# Altium project MCU.PrjPcb (part 2 of 3)

## Sheet USB.SchDoc
size A; SheetNumber: 3; SheetTotal: 10
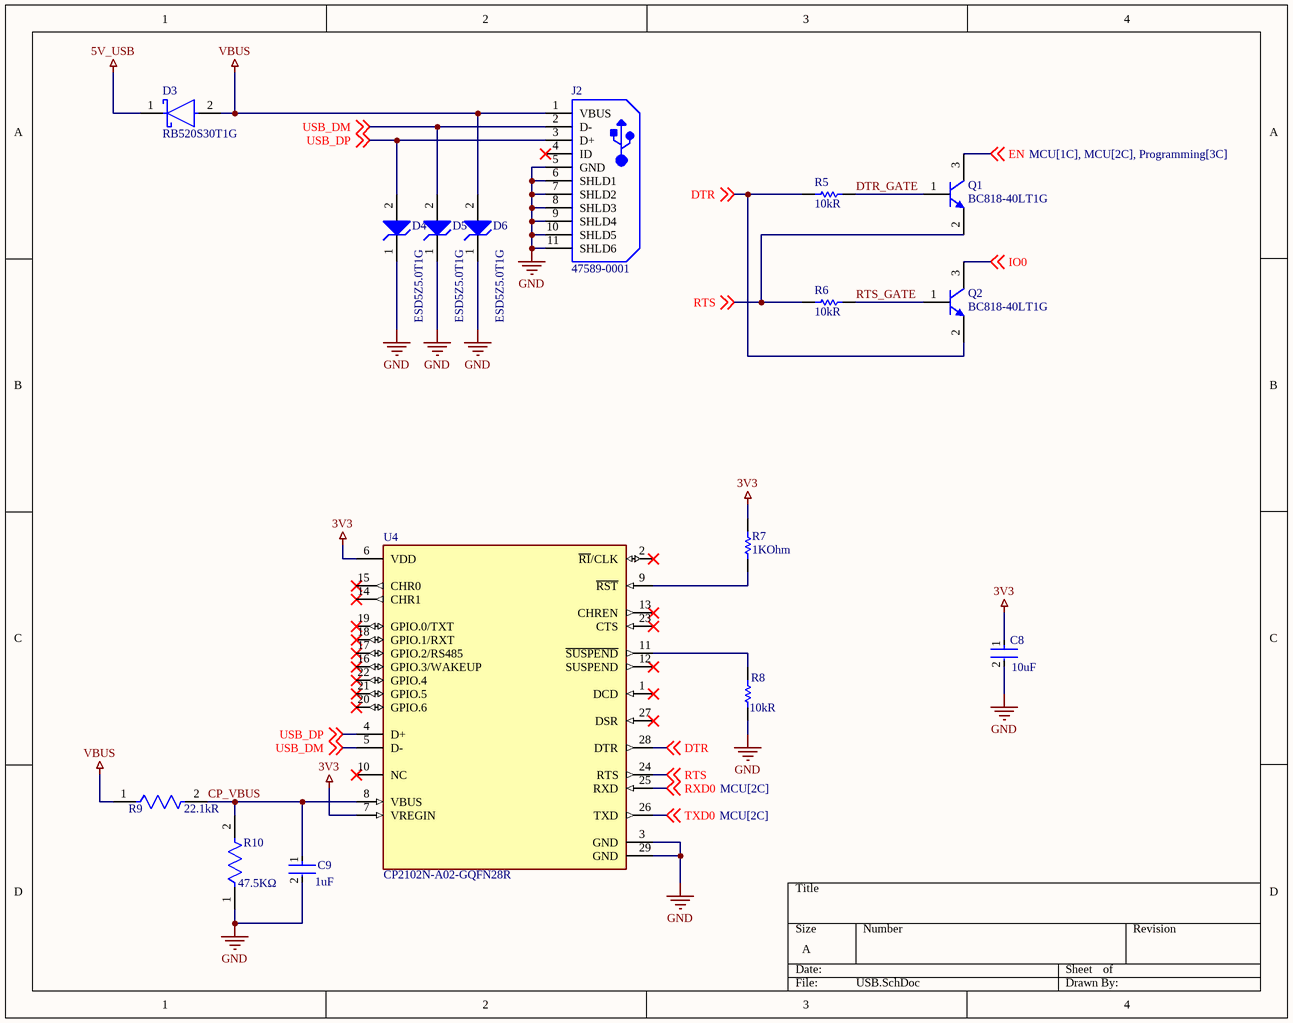
[diagram p2: USB.SchDoc]

### Parts
(Parts that share a designator on the sheet are numbered #1, #2 ... from top to bottom, then left to right.)
C8#2  value 10uF  [FP-C0805C-DG-MFG]  (hidden comment: C0805C106K8PACTU)
C9#2  Capacitance: 1uF  [FP-CL21-IPC_A]  (hidden comment: CL21B105KOFNNNE)
D3#2  RB520S30T1G  [FP-502-01-MFG]
D4#2  ESD5Z5.0T1G  [ONSC-SOD-523-2-502-01_V]
D5#1  ESD5Z5.0T1G  [ONSC-SOD-523-2-502-01_V]
D6  ESD5Z5.0T1G  [ONSC-SOD-523-2-502-01_V]
J2#1  47589-0001  [MOLX-47589-0001_V]
Q1#1  BC818-40LT1G  [ONSC-SOT-23-3-318-08_V]
Q2  BC818-40LT1G  [ONSC-SOT-23-3-318-08_V]
R5#2  value 10kR  [RESC2013X60X35NL10T20]  (hidden comment: RC0805FR-0710KL)
R6#2  value 10kR  [RESC2013X60X35NL10T20]  (hidden comment: RC0805FR-0710KL)
R7#2  Resistance: 1KOhm  [RESC2013X60X35ML10T20]  (hidden comment: RC0805FR-071KL)
R8  value 10kR  [RESC2013X60X35NL10T20]  (hidden comment: RC0805FR-0710KL)
R9#2  Resistance: 22.1kR  [FP-RMCF0805-IPC_B]  (hidden comment: RMCF0805FT22K1)
R10#2  value 47.5KΩ  [FP-RN732A-MFG]  (hidden comment: RN73C2A47K5BTD)
U4#1  CP2102N-A02-GQFN28R  [FP-CP2102N-A02-GQFN28R-MFG]

### Nets
3V3: C8#2.1 R7#2.2 U4#1.6(VDD) U4#1.7(VREGIN)
5V_USB: D3#2.1(C)
GND: C8#2.2 C9#2.2 D4#2.1(K) D5#1.1(K) D6.1(K) J2#1.5(GND) J2#1.6(SHLD1) J2#1.7(SHLD2) J2#1.8(SHLD3) J2#1.9(SHLD4) J2#1.10(SHLD5) J2#1.11(SHLD6) R8.1 R10#2.1 U4#1.3(GND) U4#1.29(GND)
VBUS: D3#2.2(A) D6.2(A) J2#1.1(VBUS) R9#2.1
CP_VBUS: C9#2.1 R9#2.2 R10#2.2 U4#1.8(VBUS)
DTR: Q2.2(E) R5#2.1 U4#1.28(DTR) ; off-sheet DTR
DTR_GATE: Q1#1.1(B) R5#2.2
EN: Q1#1.3(C) ; off-sheet EN
IO0: Q2.3(C) ; off-sheet IO0
RTS: Q1#1.2(E) R6#2.2 U4#1.24(RTS) ; off-sheet RTS
RTS_GATE: Q2.1(B) R6#2.1
RXD0: U4#1.25(RXD) ; off-sheet RXD0
TXD0: U4#1.26(TXD) ; off-sheet TXD0
USB_DM: D5#1.2(A) J2#1.2(D-) U4#1.5(D-) ; off-sheet USB_DM
USB_DP: D4#2.2(A) J2#1.3(D+) U4#1.4(D+) ; off-sheet USB_DP
NetR7#2_1: R7#2.1 U4#1.9(~{RST})
NetR8_2: R8.2 U4#1.11(~{SUSPEND})

Not connected (* = marked no-connect by the designer): J2#1 4(ID)*; U4#1 1(DCD)* 2(~{RI}/CLK)* 10(NC)* 12(SUSPEND)* 13(CHREN)* 14(CHR1)* 15(CHR0)* 16(GPIO.3/WAKEUP)* 17(GPIO.2/RS485)* 18(GPIO.1/RXT)* 19(GPIO.0/TXT)* 20(GPIO.6)* 21(GPIO.5)* 22(GPIO.4)* 23(CTS)* 27(DSR)*

### Library data of the parts
C8#2 = CMP-2007-03243-2: CAP CER 10UF 10V X5R 0805; Manufacturer: Kemet; 3DS Part Number: 220-00001; Tolerance: 10%; Temperature Coefficient: 15%; Material: Ceramic; Multilayer: Yes; Device Class L2: Capacitors; Device Class L1: Passive Components; ComponentLink2URL: https://content.kemet.com/datasheets/KEM_C1006_X5R_SMD.pdf; Height: 1.4mm; Lead Free: Yes; Manufacturer Part Number: C0805C106K8PACTU; Digikey Description: CAP CER 10UF 10V X5R 0805; Octopart: https://octopart.com/c0805c106k8pactu-kemet-98697; Capacitance: 10uF; Temperature Range Low: -55°C; Temperature: -55°C to +85°C; Automotive: No; Mouser Description: CAP CER 10UF 10V X5R 0805; Ipc Land Pattern Name: CAPC200125X125; Temperature Range High: +85°C; Voltage: 10V; RoHS: TRUE; Device Class L3: Ceramic Capacitors; ComponentLink2Description: Datasheet; Voltage Rating: 10V; Package: C0805C-DG; Temperature Characteristic: X5R; Category: Cap; Supplier: Digikey; Supplier Part Number: 399-C0805C106K8PAC7800DKR-ND; Stock: 5628606; Pricing: 1=0.14, 10=0.098, 50=0.0584, 100=0.0459, 500=0.03388, 1000=0.02805 (USD); Mounting Technology: Surface Mount; Pins: 2; Dielectric Material: Ceramic; Package Shape: Rectangular; Case/Package: 0805; Terminal Finish: Nickel; Min Operating Temperature: -55°C; Max Operating Temperature: 85°C; JESD-609 Code: e3; Capacitor Type: Ceramic; Tolerance  (fill in as +-): 10%; Package Style: SMTMeter; Packaging: Tape and Reel; Tolerance (fill in as +-): 10%; Rated DC Voltage (URdc): 10V; Termination: Wraparound; Temperature Characteristics Code: X5R; Length: 2mm; Width: 1.25mm; Reach SVHC Compliant: Yes; RoHS Compliant: Yes; ComponentLink1URL: https://datasheet.ciiva.com:443/pdfs/VipMasterIC/IC/KEME/KEME-S-A0008991665/KEME-S-A0008991665-1.pdf?src-supplier=IHS+Markit; ComponentLink1Description: https://datasheet.ciiva.com:443/pdfs/VipMasterIC/IC/KEME/KEME-S-A0008991665/KEME-S-A0008991665-1.pdf?src-supplier=IHS+Markit
C9#2 = CMP-13271-003098-1: CL21 Series 0805 1uF 16V ±10% Tolerance X7R Multilayer Ceramic Chip Capacitor; Manufacturer: Samsung; Multilayer: Yes; Case Code (Metric): 2012; Width: 0.049inch; Thickness: 0.053inch; Voltage Rating: 16V; Max Operating Temperature: 125°C; Case Code (Imperial): 0805; Height: 1.25mm; Length: 2mm; Case/Package: 0805; Lead Free: Lead Free; Mount: Surface Mount; Tolerance: 10%; Voltage Rating (DC): 16V; Min Operating Temperature: -55°C; Contact Plating: Tin; Depth: 1.25mm; Packaging: Tape and Reel; Package Quantity: 1; Voltage: 16V; Dielectric: X7R; Radiation Hardening: No; Supplier: Digikey; Supplier Part Number: 1276-1026-1-ND; Manufacturer Part Number: CL21B105KOFNNNE; RoHS: Yes; Category: Ceramic Capacitors; Stock: 390405; Pricing: 1=0.1, 10=0.049, 50=0.028, 100=0.0217, 500=0.01636, 1000=0.01286 (USD); Mounting Technology: Surface Mount; Pins: 2; Dielectric Material: Ceramic; Package Shape: Rectangular; Terminal Finish: Nickel; JESD-609 Code: e3; Value: 1uF; Capacitor Type: Ceramic; Tolerance  (fill in as +-): 10%; Package Style: SMTMeter; Tolerance (fill in as +-): 10%; Rated DC Voltage (URdc): 16V; Temperature Characteristics Code: X7R; Termination: Wraparound; Reach SVHC Compliant: Yes; RoHS Compliant: Yes; ComponentLink1URL: https://datasheet.ciiva.com:443/pdfs/VipMasterIC/IC/SEMS/SEMS-S-A0008523115/SEMS-S-A0008523189-1.pdf?src-supplier=IHS+Markit; ComponentLink1Description: https://datasheet.ciiva.com:443/pdfs/VipMasterIC/IC/SEMS/SEMS-S-A0008523115/SEMS-S-A0008523189-1.pdf?src-supplier=IHS+Markit; ComponentLink2URL: https://datasheet.ciiva.com/25800/cl21b105kofnnne-25800257.pdf?src-supplier=Digikey; ComponentLink2Description: https://datasheet.ciiva.com/25800/cl21b105kofnnne-25800257.pdf?src-supplier=Digikey; ComponentLink3URL: https://datasheet.ciiva.com/26838/getdatasheetpartid-358361-26838673.pdf?src-supplier=Verical; ComponentLink3Description: https://datasheet.ciiva.com/26838/getdatasheetpartid-358361-26838673.pdf?src-supplier=Verical; ComponentLink4URL: https://datasheet.ciiva.com/26310/mlcc-catalogdownload2013-eng-26310166.pdf?src-supplier=Distrelec; ComponentLink4Description: https://datasheet.ciiva.com/26310/mlcc-catalogdownload2013-eng-26310166.pdf?src-supplier=Distrelec
D3#2 = CMP-1055-00482-2: DIODE SCHOTTKY 30V 200MA SOD523; Element Configuration: Single; Max Reverse Leakage Current: 1uA; Power Dissipation: 200mW; Forward Voltage: 600mV; Polarity: Standard; Min Operating Temperature: -55°C; Radiation Hardening: No; Average Rectified Current: 200mA; Height: 0.7mm; Package Quantity: 1; Number of Pins: 2; Forward Current: 200mA; Packaging: Tape and Reel; Max Repetitive Reverse Voltage (Vrrm): 30V; Max Forward Surge Current (Ifsm): 200mA; Peak Reverse Current: 1uA; Max Reverse Voltage (DC): 30V; Lead Free: Lead Free; Current Rating: 200mA; Output Current: 200mA; Contact Plating: Tin; Voltage Rating (DC): 30V; Max Operating Temperature: 150°C; Width: 0.9mm; REACH SVHC: No SVHC; Case/Package: SOD-523-2; Length: 1.3mm
D4#2 D5#1 D6 = CMP-1063-00102-1: Transient Voltage Suppressor, Micro-Packaged Diode for ESD Protection, 2-Pin SOD-523, Pb-Free, Tape and Reel; Manufacturer: On Semiconductor; V(BR) Min (V): 6.2; VRWM Max (V): 5; Number of Lines: 1; PPK Max (W): 174; IR Max (uA): 0.05; Direction: Unidirectional; Diode Element Material: SILICON; Package Body Material: Plastic; Min Breakdown Voltage: 6.2V; Diode Type: TRANS VOLTAGE SUPPRESSOR; Clamping Voltage-Max: 11.6V; Rep Pk Reverse Voltage-Max: 5V; Max Power Dissipation: 200mW; Non-rep Peak Rev Power Dis-Max: 174W; Additional Feature: UL RECOGNIZED; Reference Standard: IEC-61000-4-2; Qualification Status: Not Qualified; PackageVersion: Rev. E, 09/2010; Mounting Technology: Surface Mount; Packing: Tape and Reel; ComponentLink2URL: http://www.onsemi.cn/pub_link/Collateral/ESD5Z2.5T1-D.PDF; ComponentLink2Description: Datasheet; PackageReference: SOD-523-2-502-01; ComponentLink1Description: Manufacturer URL; ComponentLink3URL: http://www.onsemi.com/pub_link/Collateral/502-01.PDF; PackageDescription: 2-Pin SOD, Body 1.2 x 0.8 mm; ComponentLink3Description: Package Specification; ComponentLink1URL: http://www.onsemi.com/; RoHS: Pb-Free; PartNumber: ESD5Z5.0T1G; DatasheetVersion: Rev. 10; Supplier: Digikey; Supplier Part Number: ESD5Z5.0T1GOSCT-ND; Manufacturer Part Number: ESD5Z5.0T1G; Category: ESD and Circuit Protection ICs; Stock: 420044; Pricing: 1=0.24, 10=0.162, 100=0.0791, 500=0.06598, 1000=0.04584 (USD); Pins: 2; Package Shape: Rectangular; Terminal Finish: Tin; Min Operating Temperature: -55°C; Max Operating Temperature: 150°C; JESD-609 Code: e3; Polarity: Unidirectional; JESD-30 Code: R-PDSO-F2; Moisture Sensitivity Level: 1; Number of Elements: 1; Package Style: SMALL OUTLINEMeter; Surface Mount: Yes; Technology: AVALANCHE; Terminal Form: Flat; Terminal Position: DUAL; Reach SVHC Compliant: Yes; RoHS Compliant: Yes; ComponentLink4URL: https://datasheet.ciiva.com:443/pdfs/VipMasterIC/IC/ONSM/ONSM-S-A0006325923/ONSM-S-A0006325923-1.pdf?src-supplier=IHS+Markit; ComponentLink4Description: https://datasheet.ciiva.com:443/pdfs/VipMasterIC/IC/ONSM/ONSM-S-A0006325923/ONSM-S-A0006325923-1.pdf?src-supplier=IHS+Markit; ComponentLink5URL: https://datasheet.ciiva.com/27748/1311839-27748800.pdf?src-supplier=Jameco; ComponentLink5Description: https://datasheet.ciiva.com/27748/1311839-27748800.pdf?src-supplier=Jameco; ComponentLink6URL: https://datasheet.ciiva.com/22637/esd5z2-5t1-d-22637184.pdf?src-supplier=Element14; ComponentLink6Description: https://datasheet.ciiva.com/22637/esd5z2-5t1-d-22637184.pdf?src-supplier=Element14; ComponentLink7URL: https://datasheet.ciiva.com/15143/getdatasheetpartid-147990-15143766.pdf?src-supplier=Verical; ComponentLink7Description: https://datasheet.ciiva.com/15143/getdatasheetpartid-147990-15143766.pdf?src-supplier=Verical; ComponentLink8URL: https://datasheet.ciiva.com/30479/0900766b8125092b-30479039.pdf?src-supplier=Rs; ComponentLink8Description: https://datasheet.ciiva.com/30479/0900766b8125092b-30479039.pdf?src-supplier=Rs; ComponentLink9URL: https://datasheet.ciiva.com/22637/1878252-22637182.pdf?src-supplier=Element14; ComponentLink9Description: https://datasheet.ciiva.com/22637/1878252-22637182.pdf?src-supplier=Element14; ComponentLink10URL: https://datasheet.ciiva.com/8084/esd5z2-5t1-d-8084057.pdf?src-supplier=Avnet; ComponentLink10Description: https://datasheet.ciiva.com/8084/esd5z2-5t1-d-8084057.pdf?src-supplier=Avnet; ComponentLink11URL: https://datasheet.ciiva.com/16385/esd5z2-5t1-d-16385093.pdf?src-supplier=Future+Electronics; ComponentLink11Description: https://datasheet.ciiva.com/16385/esd5z2-5t1-d-16385093.pdf?src-supplier=Future+Electronics; ComponentLink12URL: https://datasheet.ciiva.com/339/esd5z2-5t1-d-339749.pdf?src-supplier=Digikey; ComponentLink12Description: https://datasheet.ciiva.com/339/esd5z2-5t1-d-339749.pdf?src-supplier=Digikey; ComponentLink13URL: https://datasheet.ciiva.com/339/esd5z2-5t1-d-339750.pdf?src-supplier=Digikey; ComponentLink13Description: https://datasheet.ciiva.com/339/esd5z2-5t1-d-339750.pdf?src-supplier=Digikey; ComponentLink14URL: https://datasheet.ciiva.com/339/esd5z2-5t1-d-339748.pdf?src-supplier=Digikey; ComponentLink14Description: https://datasheet.ciiva.com/339/esd5z2-5t1-d-339748.pdf?src-supplier=Digikey
J2#1 = CMP-2000-05610-1: Right Angle Female Type AB Micro USB Connector, 30 V, 1.8 A, -30 to 85 degC, RoHS, Tape and Reel; Number of Ports: 1Port; Current Rating: 1.8A; Brand: Molex; Connector Type: MicroUSBTypeABreceptacle; Number of Contacts: 5Contact; Voltage Rating: 30VAC; Color: Black; Product: MicroUSBTypeABConnectors; Package URL: http://www.molex.com/pdm_docs/sd/475890001_sd.pdf; Contact Plating: Gold; Datasheet URL: http://www.molex.com/webdocs/datasheets/pdf/en-us/0475890001_IO_CONNECTORS.pdf; Operating Temperature Range: -20Cto+85C; Termination Style: SMD/SMT; Mounting Angle: Right; Package Reference: 47589-0001; Gender: Female; Package Description: Micro USB Connector, Pitch 0.65 mm, 5 Positions, Body 7.5 x 5.6 mm; Mounting Technology: SurfaceMount; Contact Material: CopperAlloy; Packaging: Reel; RoHS: True; Standard: USB; Manufacturer URL: http://www.molex.com/; Manufacturer: Molex; Datasheet Version: 12/2016; Product Category: USBConnectors; Series: 47589
Q1#1 Q2 = CMP-1048-00772-1: General Purpose Transistor, NPN Silicon, 3-Pin SOT-23, Pb-Free, Tape and Reel; Manufacturer: On Semiconductor; fT Min (MHz): 100; IC Continuous (A): 0.5; Package Body Material: Plastic; Max Collector Current: 500mA; DC Current Gain-Min (hFE): 40; Power Dissipation-Max (Abs): 330mW; Frequency: 100MHz; Collector-emitter Voltage-Max: 25V; Number of Elements: 1; Time @ Peak Reflow Temperature-Max (s): 40s; JEDEC-95 Code: TO-236AB; Qualification Status: Not Qualified; ComponentLink1URL: http://www.onsemi.com/; ComponentLink2URL: http://www.onsemi.com/pub_link/Collateral/BC818-40LT-D.PDF; ComponentLink2Description: Datasheet; ComponentLink1Description: Manufacturer URL; ComponentLink3Description: Package Specification; Mounting Technology: Surface Mount; PackageVersion: Rev. AP, 11/2009; PartNumber: BC818-40LT1G; Packing: Tape and Reel; DatasheetVersion: Rev. 3; RoHS: TRUE; ComponentLink3URL: http://www.onsemi.cn/pub_link/Collateral/318-08.PDF; PackageDescription: 3-Pin Small Outline Transistor, Body 2.92 x 1.3 mm, Pitch 0.95 mm; Polarity: NPN; PackageReference: SOT-23-3-318-08; Supplier: Digikey; Supplier Part Number: BC818-40LT1GOSCT-ND; Manufacturer Part Number: BC818-40LT1G; Category: BJTs; Stock: 14183; Pricing: 1=0.16, 10=0.116, 100=0.0628, 500=0.0493, 1000=0.03424 (USD); Pins: 3; Terminal Finish: Tin; Package Shape: Rectangular; Transistor Element Material: SILICON; Max Operating Temperature: 150°C; JESD-609 Code: e3; Polarity/Channel Type: NPN; Moisture Sensitivity Level: 1; Surface Mount: Yes; JESD-30 Code: R-PDSO-G3; Package Style: SMALL OUTLINEMeter; Peak Reflow Temperature (Cel): 260°C; Terminal Form: Gull Wing; Terminal Position: DUAL; Reach SVHC Compliant: Yes; RoHS Compliant: Yes; ComponentLink4URL: https://datasheet.ciiva.com:443/pdfs/VipMasterIC/IC/ONSM/ONSMS37803/ONSMS37803-1.pdf?src-supplier=IHS+Markit; ComponentLink4Description: https://datasheet.ciiva.com:443/pdfs/VipMasterIC/IC/ONSM/ONSMS37803/ONSMS37803-1.pdf?src-supplier=IHS+Markit; ComponentLink5URL: https://datasheet.ciiva.com/4722/bc818-40lt1-d-4722421.pdf?src-supplier=Mouser; ComponentLink5Description: https://datasheet.ciiva.com/4722/bc818-40lt1-d-4722421.pdf?src-supplier=Mouser; ComponentLink6URL: https://datasheet.ciiva.com/16418/bc818-40lt1-d-16418519.pdf?src-supplier=Future+Electronics; ComponentLink6Description: https://datasheet.ciiva.com/16418/bc818-40lt1-d-16418519.pdf?src-supplier=Future+Electronics; ComponentLink7URL: https://datasheet.ciiva.com/980/bc818-40lt1-d-980725.pdf?src-supplier=Digikey; ComponentLink7Description: https://datasheet.ciiva.com/980/bc818-40lt1-d-980725.pdf?src-supplier=Digikey; ComponentLink8URL: https://datasheet.ciiva.com/980/bc818-40lt1-d-980726.pdf?src-supplier=Digikey; ComponentLink8Description: https://datasheet.ciiva.com/980/bc818-40lt1-d-980726.pdf?src-supplier=Digikey; ComponentLink9URL: https://datasheet.ciiva.com/980/bc818-40lt1-d-980724.pdf?src-supplier=Digikey; ComponentLink9Description: https://datasheet.ciiva.com/980/bc818-40lt1-d-980724.pdf?src-supplier=Digikey
R5#2 R6#2 R8 = CMP-1659-00013-4: Chip Resistor, 10 KOhm, +/- 1%, 0.125 W, -55 to 155 degC, 0805 (2012 Metric), RoHS, Tape and Reel; Manufacturer: Yageo; Voltage Rating: 150 V; Power: 125mW; Rated Temperature: 70°C; Temperature Coefficient: 100ppm/°C; Additional Feature: LASER TRIMMABLE; Working Voltage: 150V; Package Length: 2mm; Package Height: 0.5mm; Package Width: 1.25mm; Mount: Surface Mount; ComponentLink1Description: Manufacturer URL; ComponentLink2URL: http://www.yageo.com/documents/recent/PYu-RC_Group_51_RoHS_L_04.pdf; Pins: 2; Length: 2 mm; Min Operating Temperature: -55 degC; Height: 0.5 mm; Mounting Technology: Surface Mount; RoHSCompliant: true; REACH SVHC: No SVHC; ComponentLink1URL: http://www.yageo.com/; Max Operating Temperature: 155 degC; PackageReference: 0805; DatasheetVersion: Rev. 4, 02/2016; Package Quantity: 5000; Packaging: Tape and Reel; ComponentLink2Description: Datasheet; PackageDescription: 2-Pin Surface Mounted Device, Body 2 x 1.25 mm; Supplier: Digikey; Supplier Part Number: 311-10.0KCRCT-ND; Manufacturer Part Number: RC0805FR-0710KL; RoHS: Yes; Category: Chip SMD Resistors; Stock: 4430741; Pricing: 1=0.1, 10=0.027, 50=0.017, 100=0.0142, 500=0.00976, 1000=0.00844 (USD); Package Shape: Rectangular; Terminal Finish: Nickel; Case/Package: 0805; Tolerance: 1%; JESD-609 Code: e3; Resistor Type: FIXED RESISTOR; Construction: Chip; Package Style: SMTMeter; Technology: METAL GLAZE/THICK FILM; Termination: Wraparound; Reach SVHC Compliant: Yes; RoHS Compliant: Yes; ComponentLink3URL: https://datasheet.ciiva.com:443/pdfs/VipMasterIC/IC/YAGO/YAGO-S-A0008145938/YAGO-S-A0008145938-1.pdf?src-supplier=IHS+Markit; ComponentLink3Description: https://datasheet.ciiva.com:443/pdfs/VipMasterIC/IC/YAGO/YAGO-S-A0008145938/YAGO-S-A0008145938-1.pdf?src-supplier=IHS+Markit; ComponentLink4URL: https://datasheet.ciiva.com/11808/0900766b8106beab-11808151.pdf?src-supplier=Rs; ComponentLink4Description: https://datasheet.ciiva.com/11808/0900766b8106beab-11808151.pdf?src-supplier=Rs; ComponentLink5URL: https://datasheet.ciiva.com/46447/444164-46447563.pdf?src-supplier=Element14; ComponentLink5Description: https://datasheet.ciiva.com/46447/444164-46447563.pdf?src-supplier=Element14; ComponentLink6URL: https://datasheet.ciiva.com/2456/pyu-r-int-thick-7-2456973.pdf?src-supplier=Digikey; ComponentLink6Description: https://datasheet.ciiva.com/2456/pyu-r-int-thick-7-2456973.pdf?src-supplier=Digikey; ComponentLink7URL: https://datasheet.ciiva.com/2456/pyu-r-int-thick-7-2456974.pdf?src-supplier=Digikey; ComponentLink7Description: https://datasheet.ciiva.com/2456/pyu-r-int-thick-7-2456974.pdf?src-supplier=Digikey; ComponentLink8URL: https://datasheet.ciiva.com/2456/pyu-r-int-thick-7-2456972.pdf?src-supplier=Digikey; ComponentLink8Description: https://datasheet.ciiva.com/2456/pyu-r-int-thick-7-2456972.pdf?src-supplier=Digikey; ComponentLink9URL: https://datasheet.ciiva.com/12669/rc0805-12669688.pdf?src-supplier=Mouser; ComponentLink9Description: https://datasheet.ciiva.com/12669/rc0805-12669688.pdf?src-supplier=Mouser; ComponentLink10URL: https://datasheet.ciiva.com/16747/rc0805-16747087.pdf?src-supplier=Future+Electronics; ComponentLink10Description: https://datasheet.ciiva.com/16747/rc0805-16747087.pdf?src-supplier=Future+Electronics
R7#2 = CMP-2100-03671-1: Chip Resistor, 1 KOhm, +/- 1%, 125 mW, -55 to 155 degC, 0805 (2012 Metric), RoHS, Tape and Reel; Manufacturer: Yageo; Temperature Coefficient: 100ppm/degreesC; Voltage Rating (DC): 150V; Max Power Dissipation: 125mW; Additional Feature: LASER TRIMMABLE; Rated Temperature: 70°C; Value: 1kR; Package Height: 0.5mm; Package Length: 2mm; Package Width: 1.25mm; Number of Pins: 2; Number of Terminations: 2; Datasheet URL: http://www.yageo.com/NewPortal/yageodocoutput?fileName=/pdf/R-Chip/PYu-RC_Group_51_RoHS_L_5.pdf; Length: 0.079inch; Package Description: 2-Pin Surface Mounted Device, Body 2 x 1.25 mm; Depth: 1.25mm; Height: 0.024inch; Military Standard: Not; Case/Package: 0805; Package Reference: 0805; RoHSCompliant: true; Lead Free: LeadFree; Packaging: TapeandReel; Package Quantity: 1; Datasheet Version: Rev. 5, 10/2016; Tolerance: 1%; Min Operating Temperature: -55degC; Voltage Rating: 150V; Composition: ThickFilm; Case Code (Imperial): 0805; Power Rating: 125mW; Width: 0.049inch; Case Code (Metric): 2012; Manufacturer URL: http://www.yageo.com/; Max Operating Temperature: 155degC; REACH SVHC: Unknown; Termination: SMD/SMT; Supplier: Digikey; Supplier Part Number: 311-1.00KCRCT-ND; Manufacturer Part Number: RC0805FR-071KL; RoHS: Yes; Category: Chip SMD Resistors; Stock: 3362703; Pricing: 1=0.1, 10=0.025, 50=0.016, 100=0.0133, 500=0.00912, 1000=0.00787 (USD); Mounting Technology: Surface Mount; Pins: 2; Package Shape: Rectangular; Terminal Finish: Nickel; JESD-609 Code: e3; Resistor Type: FIXED RESISTOR; Construction: Chip; Package Style: SMTMeter; Power: 125mW; Technology: METAL GLAZE/THICK FILM; Working Voltage: 150V; Reach SVHC Compliant: Yes; RoHS Compliant: Yes; ComponentLink1URL: https://datasheet.ciiva.com:443/pdfs/VipMasterIC/IC/YAGO/YAGO-S-A0008145938/YAGO-S-A0008145938-1.pdf?src-supplier=IHS+Markit; ComponentLink1Description: https://datasheet.ciiva.com:443/pdfs/VipMasterIC/IC/YAGO/YAGO-S-A0008145938/YAGO-S-A0008145938-1.pdf?src-supplier=IHS+Markit; ComponentLink2URL: https://datasheet.ciiva.com/7941/1686128-7941719.pdf?src-supplier=Element14; ComponentLink2Description: https://datasheet.ciiva.com/7941/1686128-7941719.pdf?src-supplier=Element14; ComponentLink3URL: https://datasheet.ciiva.com/46385/444164-46385020.pdf?src-supplier=Element14; ComponentLink3Description: https://datasheet.ciiva.com/46385/444164-46385020.pdf?src-supplier=Element14; ComponentLink4URL: https://datasheet.ciiva.com/2456/pyu-r-int-thick-7-2456976.pdf?src-supplier=Digikey; ComponentLink4Description: https://datasheet.ciiva.com/2456/pyu-r-int-thick-7-2456976.pdf?src-supplier=Digikey; ComponentLink5URL: https://datasheet.ciiva.com/2456/pyu-r-int-thick-7-2456977.pdf?src-supplier=Digikey; ComponentLink5Description: https://datasheet.ciiva.com/2456/pyu-r-int-thick-7-2456977.pdf?src-supplier=Digikey; ComponentLink6URL: https://datasheet.ciiva.com/2456/pyu-r-int-thick-7-2456975.pdf?src-supplier=Digikey; ComponentLink6Description: https://datasheet.ciiva.com/2456/pyu-r-int-thick-7-2456975.pdf?src-supplier=Digikey; ComponentLink7URL: https://datasheet.ciiva.com/16850/rc0805-16850409.pdf?src-supplier=Future+Electronics; ComponentLink7Description: https://datasheet.ciiva.com/16850/rc0805-16850409.pdf?src-supplier=Future+Electronics
R9#2 = CMP-26527-001411-1: 22.1kΩ ±1% 0.125W 0805 Thick Film Chip Resistor AEC-Q200 compliant; Manufacturer: Stackpole Electronics; Temperature Coefficient: 100ppm/°C; Power Rating: 125mW; Rated Temperature: 70°C; Value: 22.1kR; Working Voltage: 150V; Package Height: 0.5mm; Package Length: 2mm; Package Width: 1.25mm; Min Operating Temperature: -55°C; Size Code: 0805; Max Operating Temperature: 155°C; Military Standard: Not; Features: Automotive AEC-Q200; Lead Free: Lead Free; Contact Plating: Tin; Tolerance: 1%; Series: RMCF; Resistor Type: Thick Film; Width: 0.049inch; Case Code (Imperial): 0805; Case/Package: 0805; Depth: 1.25mm; Mount: Surface Mount; RoHS Compliant: Yes; Max Power Dissipation: 125mW; Case Code (Metric): 2012; Height: 0.026inch; Construction: Rectangular; Number of Terminations: 2; Packaging: Tape and Reel; Radiation Hardening: No; Length: 0.079inch; Supplier: Digikey; Supplier Part Number: RMCF0805FT22K1CT-ND; Manufacturer Part Number: RMCF0805FT22K1; RoHS: Yes; Category: Chip SMD Resistors; Stock: 745768; Pricing: 1=0.1, 10=0.02, 50=0.0124, 100=0.0103, 500=0.007, 1000=0.00601 (USD); Mounting Technology: Surface Mount; Pins: 2; Package Shape: Rectangular; Terminal Finish: Nickel; JESD-609 Code: e3; Package Style: SMTMeter; Power: 125mW; Technology: METAL GLAZE/THICK FILM; Termination: Wraparound; Reference Standard: AEC-Q200; Reach SVHC Compliant: Yes; ComponentLink1URL: https://datasheet.ciiva.com:443/pdfs/VipMasterIC/IC/SEIE/SEIE-S-A0009541969/SEIE-S-A0009541969-1.pdf?src-supplier=IHS+Markit; ComponentLink1Description: https://datasheet.ciiva.com:443/pdfs/VipMasterIC/IC/SEIE/SEIE-S-A0009541969/SEIE-S-A0009541969-1.pdf?src-supplier=IHS+Markit; ComponentLink2URL: https://datasheet.ciiva.com/15193/getdatasheetpartid-409700-15193558.pdf?src-supplier=Verical; ComponentLink2Description: https://datasheet.ciiva.com/15193/getdatasheetpartid-409700-15193558.pdf?src-supplier=Verical
R10#2 = CMP-03211-007667-1: SMD Chip Resistor, Thin Film, 47.5KΩ, 100 V, 0805 [2012 Metric], 100 mW, 0.1%, RN73 Series; Manufacturer: TE Connectivity; Voltage Rating: 100V; Temperature Coefficient: 10ppm/°C; Power Rating: 0.1W; Additional Feature: PRECISION; Power: 100mW; Rated Temperature: 70°C; Category: Res; Manufacturer Part Number: RN73C2A47K5BTD; packaging: 5000 Reel; Temperature Range Low: -55°C; Device Class L3: Chip SMD Resistors; Height: 0.65mm; Automotive: No; ComponentLink2Description: Datasheet; Tolerance: 0.1%; ComponentLink2URL: https://www.te.com/commerce/DocumentDelivery/DDEController?Action=showdoc&DocId=Data+Sheet%7F1773270%7FP%7Fpdf%7FEnglish%7FENG_DS_1773270_P.pdf%7F1676162-2; RoHS: TRUE; Temperature Range High: 155°C; Lead Free: Yes; Octopart: https://octopart.com/rn73c2a47k5btd-te+connectivity-22736876; Package: RN732A; Device Class L1: Passive Components; Temperature: -55°C to 155°C; Device Class L2: Resistors; octopart_url: https://octopart.com/rn73c2a47k5btd-te+connectivity-22736876; Ipc Land Pattern Name: RESC200125X55; Resistance: 47.5KΩ; Series: RN73; Composition: Thin Film; Supplier: Digikey; Supplier Part Number: A119902CT-ND; Stock: 2760; Pricing: 1=0.73, 10=0.521, 50=0.3986, 100=0.3526, 500=0.26204, 1000=0.22944 (USD); Mounting Technology: Surface Mount; Pins: 2; Package Shape: Rectangular; Case/Package: 0805; Min Operating Temperature: -55°C; Max Operating Temperature: 125°C; Resistor Type: FIXED RESISTOR; Manufacturer Series: RN73; Technology: THIN FILM; Termination: Wraparound; Working Voltage: 100V; RoHS Compliant: Yes; ComponentLink1URL: https://datasheet.ciiva.com:443/pdfs/VipMasterIC/IC/TYEC/TYECS00448/TYECS00448-1.pdf?src-supplier=IHS+Markit; ComponentLink1Description: https://datasheet.ciiva.com:443/pdfs/VipMasterIC/IC/TYEC/TYECS00448/TYECS00448-1.pdf?src-supplier=IHS+Markit; ComponentLink3URL: https://datasheet.ciiva.com/2547/eng-ds-1773270-m-2547934.pdf?src-supplier=Digikey; ComponentLink3Description: https://datasheet.ciiva.com/2547/eng-ds-1773270-m-2547934.pdf?src-supplier=Digikey
U4#1 = CMP-08093-000007-1: IC USB TO UART BRIDGE QFN28

## Sheet Motor.SchDoc
size A; SheetNumber: 3; SheetTotal: 4
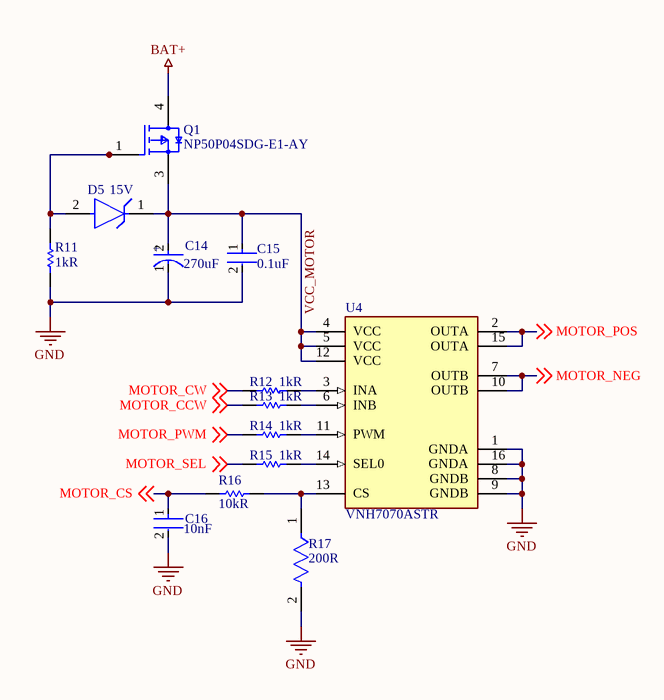
[diagram p3: Motor.SchDoc]

### Parts
(Parts that share a designator on the sheet are numbered #1, #2 ... from top to bottom, then left to right.)
C14#1  Capacitance: 270uF  [FP-EEH-G-MFG]  (hidden comment: EEHZT1V271P)
C15#1  Capacitance: 0.1uF  [FP-GCD21B-0_15-IPC_B]  (hidden comment: GCD21BR71H104MA01L)
C16#1  Capacitance: 10nF  [FP-C0805C103K8RACAUTO-MFG]  (hidden comment: C0805C103K8RACAUTO)
D5#2  Nom Zener Voltage: 15V  [FP-SOD123-MFG]  (hidden comment: MMSZ5245B-7-F)
Q1#2  NP50P04SDG-E1-AY  [DPAK230P1010X240-3_PRSS0004ZV-A_N]
R11  Resistance: 1kR  [RESC2013X60X35LL10T20]  (hidden comment: AC0805JR-071KL)
R12  Resistance: 1kR  [RESC2013X60X35LL10T20]  (hidden comment: AC0805JR-071KL)
R13#1  Resistance: 1kR  [RESC2013X60X35LL10T20]  (hidden comment: AC0805JR-071KL)
R14#1  Resistance: 1kR  [RESC2013X60X35LL10T20]  (hidden comment: AC0805JR-071KL)
R15#1  Resistance: 1kR  [RESC2013X60X35LL10T20]  (hidden comment: AC0805JR-071KL)
R16#1  value 10kR  [RESC2013X60X35NL10T20]  (hidden comment: RC0805FR-0710KL)
R17#1  Resistance: 200R  [FP-CRCW0805-HPe3-IPC_B]  (hidden comment: CRCW0805200RFKEAHP)
U4#2  VNH7070ASTR  [FP-SO-16N-GAPGCFT00818-MFG]

### Nets
BAT+: Q1#2.4(DRAIN)
GND: C14#1.1(C) C15#1.2 C16#1.2 R11.1 R17#1.2 U4#2.1(GNDA) U4#2.8(GNDB) U4#2.9(GNDB) U4#2.16(GNDA)
MOTOR_CCW: R13#1.1 ; off-sheet MOTOR_CCW
MOTOR_CS: C16#1.1 R16#1.1 ; off-sheet MOTOR_CS
MOTOR_CW: R12.1 ; off-sheet MOTOR_CW
MOTOR_NEG: U4#2.7(OUTB) U4#2.10(OUTB) ; off-sheet MOTOR_NEG
MOTOR_POS: U4#2.2(OUTA) U4#2.15(OUTA) ; off-sheet MOTOR_POS
MOTOR_PWM: R14#1.1 ; off-sheet MOTOR_PWM
MOTOR_SEL: R15#1.1 ; off-sheet MOTOR_SEL
VCC_MOTOR: C14#1.2(A) C15#1.1 D5#2.1(C) Q1#2.3(SOURCE) U4#2.4(VCC) U4#2.5(VCC) U4#2.12(VCC)
NetD5#2_2: D5#2.2(A) Q1#2.1(GATE) R11.2
NetR12_2: R12.2 U4#2.3(INA)
NetR13#1_2: R13#1.2 U4#2.6(INB)
NetR14#1_2: R14#1.2 U4#2.11(PWM)
NetR15#1_2: R15#1.2 U4#2.14(SEL0)
NetR16#1_2: R16#1.2 R17#1.1 U4#2.13(CS)

### Notes on the sheet
- (in symbol CMP-05428-001040-1) +

### Library data of the parts
C14#1 = CMP-05428-001040-1: Conductive Polymer Hybrid Aluminum Electrolytic Capacitors 270uF ±20% 35V RADIAL SMT 10x10.2mm; RoHS Compliant: Yes
C15#1 = CMP-06035-004518-1: Chip Multilayer Ceramic Capacitors for Automotive, 0805, 0.10uF, X7R, 15%, 20%, 50V, Grade 1
C16#1 = CMP-00212-126448506-1: C0805C103K8RACAUTO Cap, 0.01UF, 10V, Mlcc, 0805 Rohs Compliant: Yes; Material: Ceramic; Dielectric: X7R; Tolerance: 10%; Height: 880µm; NexarPartId: 126448506; Voltage Rating: 10V; Voltage Rating (DC): 10V; Min Operating Temperature: -55°C; Max Operating Temperature: 125°C; Case/Package: 0805; RoHS: Compliant
D5#2 = CMP-12792-000001-1: DIODE ZENER 15V 500MW SOD123; Manufacturer: Diodes Inc.; Power Dissipation: 370mW; Max Zener Voltage: 15.75V; Max Junction Temp: +150°C; Zener Impedance: 16Ω; Standoff Height: 0mm; Reverse Voltage: 11V; Max Reverse Leakage Current: 0.1uA; Device Class L3: Zener Diodes; Device Class L2: Diodes; Automotive: No; Device Class L1: Discrete Semiconductors; ComponentLink2URL: https://www.diodes.com/assets/Datasheets/ds18010.pdf; Package: SOD123; ComponentLink2Description: Datasheet; Digikey Description: DIODE ZENER 15V 500MW SOD123; RoHS: TRUE; Temperature: -65°C to +150°C; Octopart: https://octopart.com/mmsz5245b-7-f-diodes+inc.-332054; Mouser Description: Zener Diodes 15V 500mW; Height: 1.45mm; Temperature Range Low: -65°C; Lead Free: Yes; Manufacturer Part Number: MMSZ5245B-7-F; Footprint Url: https://www.diodes.com/assets/Package-Files/SOD123.pdf; Category: Diode; Temperature Range High: +150°C
Q1#2 = CMP-00572-18642745-1: Mosfet, P -Ch, 40V, 50A, To-252 Rohs Compliant: Yes; Manufacturer Lifecycle Status: ACTIVE; Drain to Source Voltage (Vdss): -40V; Rds On Max: 9.6mΩ; Fall Time: 180ns; Continuous Drain Current (ID): -50A; Turn-On Delay Time: 13ns; Gate to Source Voltage (Vgs): -20V; Max Power Dissipation: 1.2W; Max Junction Temperature (Tj): 175°C; Turn-Off Delay Time: 405ns; Input Capacitance: 5nF; Number of Elements: 1; Number of Pins: 3; Part Family: NP50P04SDG; Harmonized Tariff Schedule (HTS) Code: 8541.21.0095; HelpURL: https://octopart.com/cad-content/api/get-model-datasheet/15189/18642745; ComponentLink2URL: https://octopart.com/cad-content/api/get-model-datasheet/15189/18642745; Max Operating Temperature: 175°C; Length: 6mm; Height: 2.4mm; Radiation Hardening: No; Lifecycle Status: Production; Mount: Surface Mount; ComponentLink2Description: Datasheet URL; ComponentLink1Description: Manufacturer's Website; ComponentLink3Description: Manufacturer's Package Drawing; Lead Free: Lead Free; RoHS: Compliant; Case/Package: TO-252; ComponentLink3URL: https://www.renesas.com/en/document/psc/package-drawing-mp-3zk-3pin-prss0004zv; Drain to Source Resistance: 9.6MΩ; ComponentLink1URL: http://www.renesas.com; China RoHS: Compliant; MSL: 1; Export Control Classification Number (ECCN) Code: EAR99; Power Dissipation: 1.2W; Min Operating Temperature: -55°C; Rise Time: 13ns; Width: 6mm
R11 R12 R13#1 R14#1 R15#1 = CMP-2001-04511-1: Manufacturer: Yageo; Part Number: AC0805JR-071KL
R16#1 = CMP-1659-00013-4: as R5#2 on sheet USB; Mount: Surface Mount; ComponentLink1Description: Manufacturer URL; ComponentLink2URL: http://www.yageo.com/documents/recent/PYu-RC_Group_51_RoHS_L_04.pdf; Pins: 2; Length: 2 mm; Min Operating Temperature: -55 degC; Height: 0.5 mm; Mounting Technology: Surface Mount; RoHSCompliant: true; REACH SVHC: No SVHC; ComponentLink1URL: http://www.yageo.com/; Max Operating Temperature: 155 degC; PackageReference: 0805; DatasheetVersion: Rev. 4, 02/2016; Package Quantity: 5000; Packaging: Tape and Reel; ComponentLink2Description: Datasheet; PackageDescription: 2-Pin Surface Mounted Device, Body 2 x 1.25 mm; Supplier: Digikey; Supplier Part Number: 311-10.0KCRCT-ND; Manufacturer Part Number: RC0805FR-0710KL; RoHS: Yes; Category: Chip SMD Resistors; Stock: 4430741; Pricing: 1=0.1, 10=0.027, 50=0.017, 100=0.0142, 500=0.00976, 1000=0.00844 (USD); Package Shape: Rectangular; Terminal Finish: Nickel; Case/Package: 0805; Tolerance: 1%; JESD-609 Code: e3; Resistor Type: FIXED RESISTOR; Construction: Chip; Package Style: SMTMeter; Technology: METAL GLAZE/THICK FILM; Termination: Wraparound; Reach SVHC Compliant: Yes; RoHS Compliant: Yes; ComponentLink3URL: https://datasheet.ciiva.com:443/pdfs/VipMasterIC/IC/YAGO/YAGO-S-A0008145938/YAGO-S-A0008145938-1.pdf?src-supplier=IHS+Markit; ComponentLink3Description: https://datasheet.ciiva.com:443/pdfs/VipMasterIC/IC/YAGO/YAGO-S-A0008145938/YAGO-S-A0008145938-1.pdf?src-supplier=IHS+Markit; ComponentLink4URL: https://datasheet.ciiva.com/11808/0900766b8106beab-11808151.pdf?src-supplier=Rs; ComponentLink4Description: https://datasheet.ciiva.com/11808/0900766b8106beab-11808151.pdf?src-supplier=Rs; ComponentLink5URL: https://datasheet.ciiva.com/46447/444164-46447563.pdf?src-supplier=Element14; ComponentLink5Description: https://datasheet.ciiva.com/46447/444164-46447563.pdf?src-supplier=Element14; ComponentLink6URL: https://datasheet.ciiva.com/2456/pyu-r-int-thick-7-2456973.pdf?src-supplier=Digikey; ComponentLink6Description: https://datasheet.ciiva.com/2456/pyu-r-int-thick-7-2456973.pdf?src-supplier=Digikey; ComponentLink7URL: https://datasheet.ciiva.com/2456/pyu-r-int-thick-7-2456974.pdf?src-supplier=Digikey; ComponentLink7Description: https://datasheet.ciiva.com/2456/pyu-r-int-thick-7-2456974.pdf?src-supplier=Digikey; ComponentLink8URL: https://datasheet.ciiva.com/2456/pyu-r-int-thick-7-2456972.pdf?src-supplier=Digikey; ComponentLink8Description: https://datasheet.ciiva.com/2456/pyu-r-int-thick-7-2456972.pdf?src-supplier=Digikey; ComponentLink9URL: https://datasheet.ciiva.com/12669/rc0805-12669688.pdf?src-supplier=Mouser; ComponentLink9Description: https://datasheet.ciiva.com/12669/rc0805-12669688.pdf?src-supplier=Mouser; ComponentLink10URL: https://datasheet.ciiva.com/16747/rc0805-16747087.pdf?src-supplier=Future+Electronics; ComponentLink10Description: https://datasheet.ciiva.com/16747/rc0805-16747087.pdf?src-supplier=Future+Electronics
R17#1 = CMP-02407-008327-1: RES Thick Film, 200Ω, 1%, 0.5W, 100ppm/°C, 0805; Max Power Dissipation: 500mW; Min Operating Temperature: -55°C; Composition: Thick Film; Depth: 1.25mm; Max Operating Temperature: 155°C; Case/Package: 0805; Height: 0.024inch; Length: 2mm; Package Quantity: 5000; Military Standard: Not; Mount: Surface Mount; Contact Plating: Tin; Width: 0.049inch; Radiation Hardening: No; Packaging: Tape and Reel; Features: Automotive AEC-Q200; Number of Terminations: 2; Tolerance: 1%; Temperature Coefficient: 100ppm/°C; Lead Free: Lead Free
U4#2 = CMP-2000-07519-2: IC MOTOR DRIVER 4V-28V 16SOIC; Manufacturer: STMicroelectronics; Standoff Height: 0.1mm; Number Of Outputs: 2; Max Junction Temp: +150°C; Output Current: 15A; Max Supply Voltage: 28V; Automotive Grade: Grade 0; Motor Type: Brushed; Min Supply Voltage: 4V; Nominal Supply Current: 2-3.5mA; Digikey Description: IC MOTOR DRIVER 4V-28V 16SOIC; Device Class L1: Integrated Circuits (ICs); Ipc Land Pattern Name: SOIC127P600X175-16; Device Class L2: Power Management ICs; ComponentLink2Description: Datasheet; ComponentLink2URL: https://www.st.com/resource/en/datasheet/vnh7070as.pdf; Height: 1.75mm; RoHS: TRUE; Manufacturer Part Number: VNH7070ASTR; Octopart: https://octopart.com/vnh7070astr-stmicroelectronics-66668687; Temperature Range Low: -40°C; Mouser Description: STMicroelectronics VNH7070ASTR Motor Driver IC 16-Pin, SOIC; Device Class L3: Motor Drivers; Lead Free: Yes; Temperature: -40°C to +150°C; Automotive: Yes; Package: SO-16N-GAPGCFT00818; Temperature Range High: +150°C; Category: IC; Footprint Url: https://www.st.com/resource/en/datasheet/l6566a.pdf

## Sheet Programming.SchDoc
size A; SheetNumber: 5; SheetTotal: 10
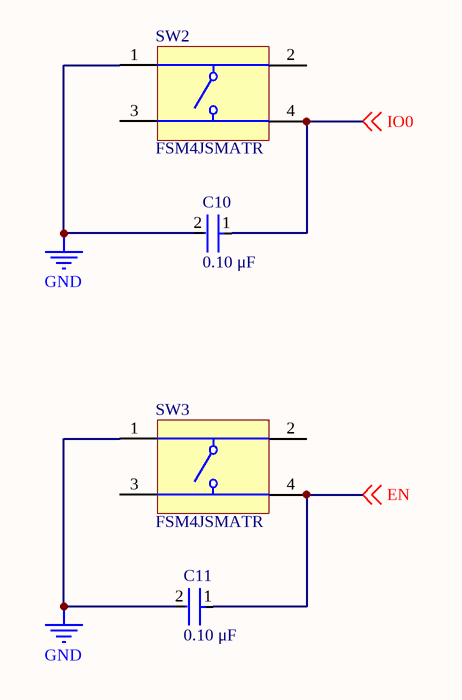
[diagram p4: Programming.SchDoc]

### Parts
(Parts that share a designator on the sheet are numbered #1, #2 ... from top to bottom, then left to right.)
C10#2  Capacitance: 0.10 μF  [FP-C0603C-CF-MFG]  (hidden comment: C0603C104K5RACTU)
C11#2  Capacitance: 0.10 μF  [FP-C0603C-CF-MFG]  (hidden comment: C0603C104K5RACTU)
SW2#2  FSM4JSMATR  [TECO-FSM4JSMATR_V]
SW3#2  FSM4JSMATR  [TECO-FSM4JSMATR_V]

### Nets
GND: C10#2.2 C11#2.2 SW2#2.1 SW3#2.1
EN: C11#2.1 SW3#2.4 ; off-sheet EN
IO0: C10#2.1 SW2#2.4 ; off-sheet IO0

Not connected (* = marked no-connect by the designer): SW2#2 2 3; SW3#2 2 3

### Library data of the parts
C10#2 C11#2 = CMP-2006-03061-2: CAP CER 0.1UF 50V X7R 0603; Manufacturer: KEMET; Tolerance: 0.1; Temperature Coefficient: 30ppm/°C; Material: Ceramic; Automotive Grade: Grade 1; Value: 0.10 μF; Multilayer: Yes; Tolerance  (fill in as +-): 10%; Temperature: -55°C to +125°C; RoHS: TRUE; Temperature Range High: +125°C; Lead Free: Yes; Octopart: https://octopart.com/c0603c104k5ractu-kemet-139244; Digikey Description: CAP CER 0.1UF 50V X7R 0603; Category: Cap; Package: C0603C-CF; ComponentLink2Description: Datasheet; Temperature Range Low: -55°C; Device Class L1: Passive Components; Voltage Rating: 50 V; Automotive: Yes; Device Class L3: Ceramic Capacitors; ComponentLink2URL: https://api.kemet.com/component-edge/download/datasheet/C0603C100J5GACAUTO.pdf; Device Class L2: Capacitors; Manufacturer Part Number: C0603C104K5RACTU; Temperature Characteristic: X7R; Height: 0.87mm; Supplier: Digikey; Supplier Part Number: 399-C0603C104K5RAC7867CT-ND; Stock: 4063890; Pricing: 1=0.11, 10=0.074, 50=0.0424, 100=0.0329, 500=0.02474, 1000=0.01944 (USD); Mounting Technology: Surface Mount; Pins: 2; Dielectric Material: Ceramic; Package Shape: Rectangular; Case/Package: 0603; Terminal Finish: Nickel; Min Operating Temperature: -55°C; Max Operating Temperature: 125°C; JESD-609 Code: e3; Capacitor Type: Ceramic; Package Style: SMTMeter; Packaging: Tape and Reel; Tolerance (fill in as +-): 10%; Rated DC Voltage (URdc): 50V; Temperature Characteristics Code: X7R; Termination: Wraparound; Length: 1.6mm; Width: 0.8mm; Reach SVHC Compliant: Yes; RoHS Compliant: Yes; ComponentLink1URL: https://datasheet.ciiva.com:443/pdfs/VipMasterIC/IC/KEME/KEME-S-A0008991654/KEME-S-A0008991654-1.pdf?src-supplier=IHS+Markit; ComponentLink1Description: https://datasheet.ciiva.com:443/pdfs/VipMasterIC/IC/KEME/KEME-S-A0008991654/KEME-S-A0008991654-1.pdf?src-supplier=IHS+Markit
SW2#2 SW3#2 = CMP-2000-07486-1: Micro Miniature Push Button Switch FSM JSM, 50 mA, -35 to 85 degC, 4-Pin SMD, RoHS, Tape and Reel; Manufacturer: TE Connectivity; Mechanical Life: 100000Cycles; Current Rating: 50mA; Actuator Material: Polyamide; Max Voltage Rating (DC): 12V; Capacitance: 0f; Illumination Type: Illuminated; Voltage Rating (DC): 24V; Case\/Package: SMD/SMT; Operating Force: 160gf; Contact Resistance: 100mOhm; Actuator Length: 0.055inch; Switch Travel: 0.25mm; Throw Configuration: SPST; Circuit Configuration: 1X1; Contact DC Max Rating R Load: .05A@12VDC; Number of Switches: 1; Operating Force-Max: 2.06N; Switch Action: MOMENTARY-TACTILE; Switch Type: Keypad; Body Breadth: 6inch; Body Height: 3.6mm; Body Length or Diameter: 6mm; Termination: GullWing; Contact Plating: Silver; Orientation: Straight; Mounting Technology: SurfaceMount; REACH SVHC: Unknown; Electrical Life: 100000Cycles; Package Reference: FSM4JSMATR; Max Operating Temperature: 85degC; Manufacturer URL: http://www.te.com/; Package Description: 4-Pin Surface Mount Device, Body 6 x 6 mm, Pitch 4.5 mm; Datasheet Version: Rev. V, 02/2015; Packaging: TapeandReel; Min Operating Temperature: -35degC; Mount: SurfaceMount; Contact Current Rating: 50mA; Contact Material: CopperAlloy; Package Quantity: 1200; Datasheet URL: http://www.te.com/commerce/DocumentDelivery/DDEController?Action=showdoc&DocId=Customer+Drawing%7F2-1437565-7%7FV%7Fpdf%7FEnglish%7FENG_CD_2-1437565-7_V.pdf%7F4-1437565-2; RoHSCompliant: true; Supplier: Digikey; Supplier Part Number: 450-1759-1-ND; Manufacturer Part Number: FSM4JSMATR; RoHS: Yes; Category: Pushbutton Switches; Stock: 69097; Pricing: 1=0.36, 10=0.351, 25=0.33, 100=0.2866, 250=0.26, 500=0.24188 (USD); Terminal Finish: Silver; JESD-609 Code: e4; Contact Current(DC)-Max: 50mA; Contact Voltage(DC)-Max: 12V; Switch Function: SPST; Reach SVHC Compliant: Yes; RoHS Compliant: Yes; ComponentLink1URL: https://datasheet.ciiva.com:443/pdfs/VipMasterIC/IC/TYEL/TYEL-S-A0008743874/TYEL-S-A0008712894-1.pdf?src-supplier=IHS+Markit; ComponentLink1Description: https://datasheet.ciiva.com:443/pdfs/VipMasterIC/IC/TYEL/TYEL-S-A0008743874/TYEL-S-A0008712894-1.pdf?src-supplier=IHS+Markit; ComponentLink2URL: https://datasheet.ciiva.com/5801/eng-cd-2-1437565-7-u2-5801346.pdf?src-supplier=Farnell; ComponentLink2Description: https://datasheet.ciiva.com/5801/eng-cd-2-1437565-7-u2-5801346.pdf?src-supplier=Farnell; ComponentLink3URL: https://datasheet.ciiva.com/23765/1486934-23765878.pdf?src-supplier=Newark; ComponentLink3Description: https://datasheet.ciiva.com/23765/1486934-23765878.pdf?src-supplier=Newark; ComponentLink4URL: https://datasheet.ciiva.com/1530/1683375-1530944.pdf?src-supplier=Element14; ComponentLink4Description: https://datasheet.ciiva.com/1530/1683375-1530944.pdf?src-supplier=Element14; ComponentLink5URL: https://datasheet.ciiva.com/16320/eng-cs-1308111-1-switches-core-program-catalog-0308-16320065.pdf?src-supplier=Future+Electronics; ComponentLink5Description: https://datasheet.ciiva.com/16320/eng-cs-1308111-1-switches-core-program-catalog-0308-16320065.pdf?src-supplier=Future+Electronics; ComponentLink6URL: https://datasheet.ciiva.com/7638/921681-7638037.pdf?src-supplier=Element14; ComponentLink6Description: https://datasheet.ciiva.com/7638/921681-7638037.pdf?src-supplier=Element14